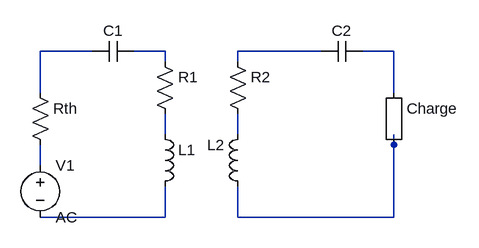
[diagram p0: schematic Draft2.asc]
Draft2.asc, the LTspice schematic file:
Version 4
SHEET 1 880 680
WIRE -48 48 -128 48
WIRE 64 48 16 48
WIRE 304 48 176 48
WIRE 416 48 368 48
WIRE 64 64 64 48
WIRE 176 64 176 48
WIRE -128 112 -128 48
WIRE 416 112 416 48
WIRE 64 176 64 144
WIRE 176 176 176 144
WIRE 416 192 416 176
WIRE -128 224 -128 192
WIRE 64 304 64 256
WIRE 64 304 -128 304
WIRE 176 304 176 256
WIRE 416 304 416 192
WIRE 416 304 176 304
SYMBOL ind 48 160 R0
SYMATTR InstName L1
SYMATTR Value ""
SYMBOL ind 192 272 R180
WINDOW 0 36 80 Left 2
WINDOW 3 36 40 Left 2
SYMATTR InstName L2
SYMATTR Value ""
SYMBOL cap 16 32 R90
WINDOW 0 0 32 VBottom 2
WINDOW 3 32 32 VTop 2
SYMATTR InstName C1
SYMATTR Value ""
SYMBOL cap 304 64 R270
WINDOW 0 32 32 VTop 2
WINDOW 3 0 32 VBottom 2
SYMATTR InstName C2
SYMATTR Value ""
SYMBOL res 160 48 R0
SYMATTR InstName R2
SYMATTR Value ""
SYMBOL res 48 48 R0
SYMATTR InstName R1
SYMATTR Value ""
SYMBOL res -144 96 R0
SYMATTR InstName Rth
SYMATTR Value ""
SYMBOL voltage -128 208 R0
WINDOW 123 0 0 Left 0
WINDOW 39 0 0 Left 0
SYMATTR InstName V1
SYMATTR Value AC
SYMBOL Misc\\EuropeanResistor 400 96 R0
SYMATTR InstName Charge
SYMATTR Value ""

The netlist it stands for:
* Draft2.asc
L1 N005 N009
L2 N007 N006
C1 N002 N001
C2 N003 N004
R2 N003 N006
R1 N002 N005
Rth N001 N008
V1 N008 N009 AC
R§Charge N004 N007
.backanno
.end